# Altium schematic sheet Main.SchDoc
size A; SheetNumber: 1
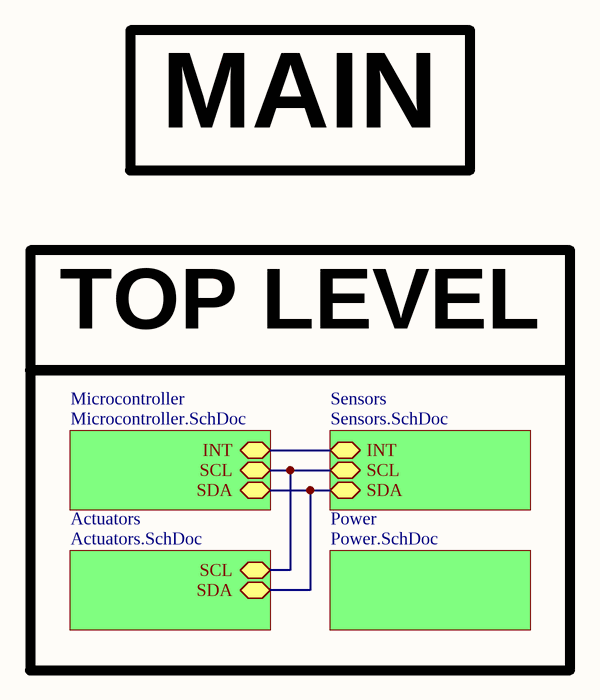
[diagram p0: Main.SchDoc]

## Sub-sheets
Actuators = Actuators.SchDoc: SCL, SDA
Microcontroller = Microcontroller.SchDoc: SCL, SDA, INT
Power = Power.SchDoc: no entries
Sensors = Sensors.SchDoc: SCL, SDA, INT

## Nets
(unnamed): sheet Microcontroller/SCL, sheet Sensors/SCL, sheet Actuators/SCL
(unnamed): sheet Microcontroller/SDA, sheet Sensors/SDA, sheet Actuators/SDA
(unnamed): sheet Microcontroller/INT, sheet Sensors/INT

## Notes on the sheet
- MAIN
- TOP LEVEL